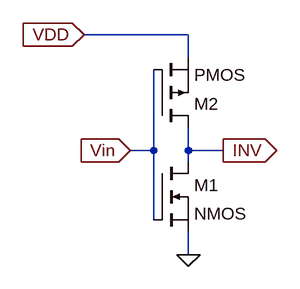
[diagram p0: schematic INV.asc]
INV.asc, the LTspice schematic file:
Version 4
SHEET 1 880 680
WIRE 256 16 112 16
WIRE 256 48 256 16
WIRE 208 176 208 64
WIRE 208 176 176 176
WIRE 256 176 256 144
WIRE 304 176 256 176
WIRE 256 192 256 176
WIRE 208 272 208 176
WIRE 256 320 256 288
FLAG 256 320 0
FLAG 112 16 VDD
IOPIN 112 16 In
FLAG 176 176 Vin
IOPIN 176 176 In
FLAG 304 176 INV
IOPIN 304 176 Out
SYMBOL nmos 208 192 R0
SYMATTR InstName M1
SYMBOL pmos 208 144 M180
SYMATTR InstName M2

The netlist it stands for:
* INV.asc
M1 INV Vin 0 0 NMOS
M2 INV Vin VDD VDD PMOS
.model NMOS NMOS
.model PMOS PMOS
.lib standard.mos
.backanno
.end